# Altium schematic sheet Power.SchDoc
size A4; Organization: Altium Limited; Address1: L3, 12a Rodborough Rd; Address2: Frenchs Forest; Address3: NSW; Address4: Australia 2086
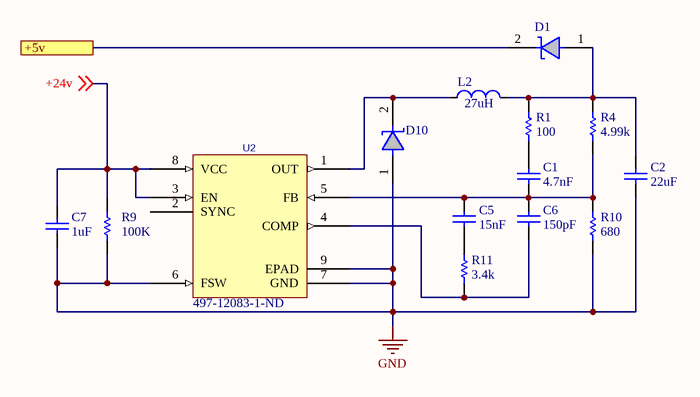
[diagram p0: Power.SchDoc]

## Parts
C1  value 4.7nF  [0603]  (hidden comment: CAP_2)
C2  value 22uF  [0603]  (hidden comment: CAP_1_25)
C5  value 15nF  [0603]  (hidden comment: CAP_1_17)
C6  value 150pF  [0402]  (hidden comment: CAP_1_16)
C7  value 1uF  [0402]  (hidden comment: CAP_1_21_3)
D1  SCHOTTKY DIODE  [SOD323]  (value not drawn)
D10  SCHOTTKY DIODE  [SOD323]  (value not drawn)
L2  Inductance: 27uH  [0603]  (hidden comment: INDUCTOR)
R1  value 100  [0603]  (hidden comment: RES_9)
R4  value 4.99k  [0402]  (hidden comment: RES_38)
R9  value 100K  [0402]  (hidden comment: RES_11)
R10  value 680  [0402]  (hidden comment: RES_49)
R11  value 3.4k  [0603]  (hidden comment: RES_32)
U2  Supplier Part Number 1: 497-12083-1-ND  [L7986ATR]  (hidden comment: L7986ATR)

## Ports
+5v

## Nets
GND: C2.1 C7.1 D10.1(A) R9.2 R10.1 U2.6(FSW) U2.7(GND) U2.9(EPAD)
+5v: D1.2(K) ; port +5v
+24v: C7.2 R9.1 U2.3(EN) U2.8(VCC) ; off-sheet +24v
NetC1_1: C1.1 R1.1
NetC1_2: C1.2 C5.2 C6.2 R4.1 R10.2 U2.5(FB)
NetC2_2: C2.2 D1.1(A) L2.2 R1.2 R4.2
NetC5_1: C5.1 R11.2
NetC6_1: C6.1 R11.1 U2.4(COMP)
NetD10_2: D10.2(K) L2.1 U2.1(OUT)

Not connected (* = marked no-connect by the designer): U2 2(SYNC)

## Notes on the sheet
- Title
- Size:
- Date:
- A4
- Number:
- Time:
- Revision:
- Sheet
- of
- File:

## Library data of the parts
C1 = CAP_2: 4.7nF 10% 50V; Tolerance: 10%; Voltage: 50V
C2 = CAP_1_25: 22uF 20% 6.3V; Tolerance: 20%; Voltage: 6.3V
C5 = CAP_1_17: 15nF 10% 50V; Tolerance: 10%; Voltage: 50V
C6 = CAP_1_16: 150pF 5% 50V; Tolerance: 5%; Voltage: 50V
C7 = CAP_1_21_3: 1uF 10% 50V
R1 = RES_9: RES 100 0.1W ±1% 0603 (1608); Power: *; Tolerance: *
R4 = RES_38: RES 4.99K ±1% 0603 (1608); Power: *; Tolerance: *
R9 = RES_11: RES 100K 0.1W ±1% 0603 (1608 Metric)
R10 = RES_49: RES 680 ±1% 0603 (1608); Power: *; Tolerance: *
R11 = RES_32: RES 3.4K ±1% 0603 (1608); Power: *; Tolerance: *
U2 = L7986ATR: IC Switching Regulator 3A STEP-DOWN 8-HSOP; Title: L7986TATR; Supplier 1: Digi-Key
L2 = INDUCTOR: Current: *; Resistance: *